# Altium project PCB_Project.PrjPCB
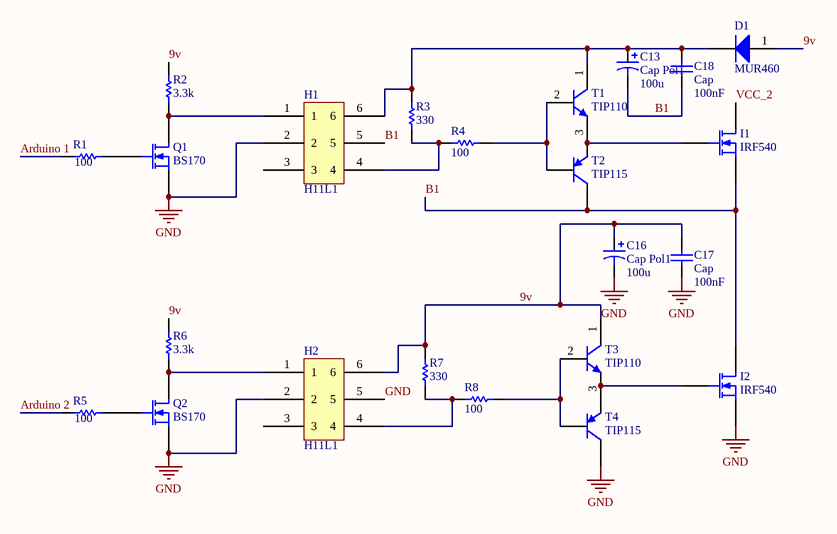
[diagram p0: puente H rama 1.SchDoc]
4 sheets, 82 parts. Net scope: global (net labels, ports and power ports of the same name join across sheets).
Board file: PCB1.PcbDoc
Sheets:
  puente H rama 1.SchDoc
  puente H rama 2.SchDoc
  alimentacion.SchDoc
  micro.SchDoc

## Sheet puente H rama 1.SchDoc
size A4

### Parts
C13  Cap Pol1  value 100u  [A]
C16  Cap Pol1  value 100u  [A]
C17  Cap  value 100nF  [C1206]
C18  Cap  value 100nF  [C1206]
D1  MUR460  [DO-201AD]
H1  H11L1  [DIP-6]
H2  H11L1  [DIP-6]
I1  IRF540  [TO-220AB]
I2  IRF540  [TO-220-AB]
Q1  BS170  [E3]
Q2  BS170  [E3]
R1  value 100  [3216[1206]]  (hidden comment: Res1)
R2  value 3.3k  [3216[1206]]  (hidden comment: Res1)
R3  value 330  [3216[1206]]  (hidden comment: Res1)
R4  value 100  [3216[1206]]  (hidden comment: Res1)
R5  value 100  [3216[1206]]  (hidden comment: Res1)
R6  value 3.3k  [3216[1206]]  (hidden comment: Res1)
R7  value 330  [3216[1206]]  (hidden comment: Res1)
R8  value 100  [3216[1206]]  (hidden comment: Res1)
T1  TIP110  [TO-220-AB]
T2  TIP115  [TO-220-AB]
T3  TIP110  [TO-220-AB]
T4  TIP115  [TO-220-AB]

### Nets
GND: C16.2 C17.1 H1.2 H2.2 H2.5 I2.3(S) Q1.3(S) Q2.3(S) T4.1(C)
9v: C16.1 C17.2 D1.1(A) H2.6 R2.2 R6.2 R7.2 T3.1(C)
Arduino 1: R1.1
Arduino 2: R5.1
B1: C13.2 C18.1 H1.5 I1.3(S) I2.1(D) T2.1(C)
VCC_2: I1.1(D)
NetC13_1: C13.1 C18.2 D1.2(K) H1.6 R3.2 T1.1(C)
NetH1_1: H1.1 Q1.1(D) R2.1
NetH1_4: H1.4 R3.1 R4.2
NetH2_1: H2.1 Q2.1(D) R6.1
NetH2_4: H2.4 R7.1 R8.2
NetI1_2: I1.2(G) T1.3(E) T2.3(E)
NetI2_2: I2.2(G) T3.3(E) T4.3(E)
NetQ1_2: Q1.2(G) R1.2
NetQ2_2: Q2.2(G) R5.2
NetR4_1: R4.1 T1.2(B) T2.2(B)
NetR8_1: R8.1 T3.2(B) T4.2(B)

Not connected (* = marked no-connect by the designer): H1 3; H2 3

### Library data of the parts
C13 C16 = Cap Pol1: Polarized Capacitor (Radial); Published: 8-Jun-2000; LatestRevisionDate: 17-Jul-2002; LatestRevisionNote: Re-released for DXP Platform.; PackageReference: RB7.6-15; Publisher: Altium Limited
C17 C18 = Cap: Capacitor; Published: 8-Jun-2000; LatestRevisionDate: 17-Jul-2002; LatestRevisionNote: Re-released for DXP Platform.; PackageReference: RAD-0.3; Publisher: Altium Limited
D1 = Diode: Default Diode; Published: 8-Jun-2000; LatestRevisionDate: 17-Jul-2002; LatestRevisionNote: Re-released for DXP Platform.; PackageDocument: Sep-1996; PackageReference: SMC; Publisher: Altium Limited; Code_JEDEC: DO-214-AB
I1 I2 = MOSFET-N: N-Channel MOSFET; pin to pad: 1>2 2>1; PackageDocument: 1995/1996; Published: 8-Jun-2000; LatestRevisionDate: 17-Jul-2002; LatestRevisionNote: Re-released for DXP Platform.; PackageReference: E3; Publisher: Altium Limited
Q1 Q2 = MOSFET-N: N-Channel MOSFET; PackageDocument: 1995/1996; Published: 8-Jun-2000; LatestRevisionDate: 17-Jul-2002; LatestRevisionNote: Re-released for DXP Platform.; PackageReference: E3; Publisher: Altium Limited
R1-R8 = Res1: Resistor; Published: 8-Jun-2000; LatestRevisionDate: 17-Jul-2002; LatestRevisionNote: Re-released for DXP Platform.; PackageReference: AXIAL-0.3; Publisher: Altium Limited
T1 T3 = NPN: NPN Bipolar Transistor; pin to pad: 1>2 2>1; Published: 8-Jun-2000; LatestRevisionDate: 17-Jul-2002; LatestRevisionNote: Re-released for DXP Platform.; PackageReference: TO-226; Publisher: Altium Limited; Code_JEDEC: TO-226-AA
T2 T4 = PNP: PNP Bipolar Transistor; pin to pad: 1>2 2>1; Published: 8-Jun-2000; LatestRevisionDate: 17-Jul-2002; LatestRevisionNote: Re-released for DXP Platform.; PackageReference: SOT-23B; Publisher: Altium Limited; Code_JEDEC: SOT-23

## Sheet puente H rama 2.SchDoc
size A4
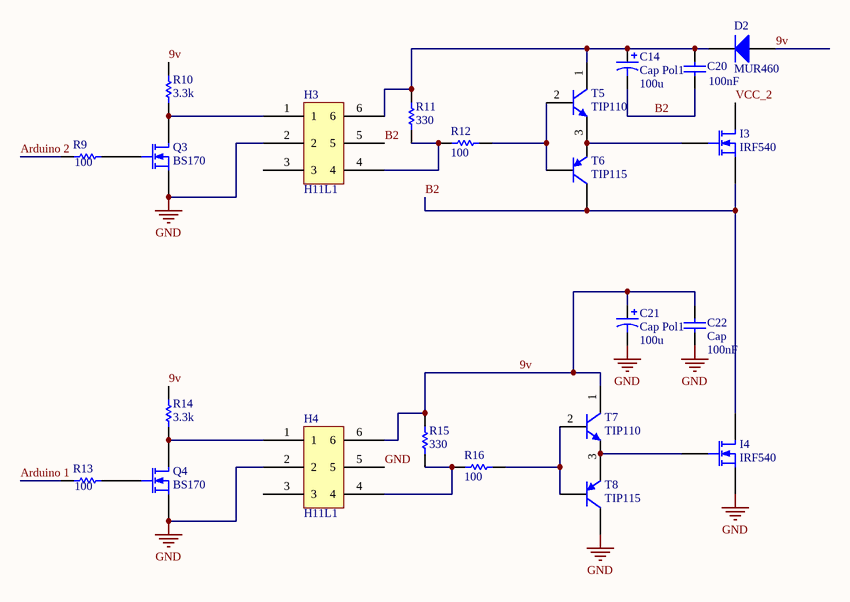
[diagram p1: puente H rama 2.SchDoc]

### Parts
C14  Cap Pol1  value 100u  [A]
C20  value 100nF  [C1206]  (hidden comment: Cap)
C21  Cap Pol1  value 100u  [A]
C22  Cap  value 100nF  [C1206]
D2  MUR460  [DO-201AD]
H3  H11L1  [DIP-6]
H4  H11L1  [DIP-6]
I3  IRF540  [TO-220AB]
I4  IRF540  [TO-220-AB]
Q3  BS170  [E3]
Q4  BS170  [E3]
R9  value 100  [3216[1206]]  (hidden comment: Res1)
R10  value 3.3k  [3216[1206]]  (hidden comment: Res1)
R11  value 330  [3216[1206]]  (hidden comment: Res1)
R12  value 100  [3216[1206]]  (hidden comment: Res1)
R13  value 100  [3216[1206]]  (hidden comment: Res1)
R14  value 3.3k  [3216[1206]]  (hidden comment: Res1)
R15  value 330  [3216[1206]]  (hidden comment: Res1)
R16  value 100  [3216[1206]]  (hidden comment: Res1)
T5  TIP110  [TO-220-AB]
T6  TIP115  [TO-220-AB]
T7  TIP110  [TO-220-AB]
T8  TIP115  [TO-220-AB]

### Nets
GND: C21.2 C22.1 H3.2 H4.2 H4.5 I4.3(S) Q3.3(S) Q4.3(S) T8.1(C)
9v: C21.1 C22.2 D2.1(A) H4.6 R10.2 R14.2 R15.2 T7.1(C)
Arduino 1: R13.1
Arduino 2: R9.1
B2: C14.2 C20.1 H3.5 I3.3(S) I4.1(D) T6.1(C)
VCC_2: I3.1(D)
NetC14_1: C14.1 C20.2 D2.2(K) H3.6 R11.2 T5.1(C)
NetH3_1: H3.1 Q3.1(D) R10.1
NetH3_4: H3.4 R11.1 R12.2
NetH4_1: H4.1 Q4.1(D) R14.1
NetH4_4: H4.4 R15.1 R16.2
NetI3_2: I3.2(G) T5.3(E) T6.3(E)
NetI4_2: I4.2(G) T7.3(E) T8.3(E)
NetQ3_2: Q3.2(G) R9.2
NetQ4_2: Q4.2(G) R13.2
NetR12_1: R12.1 T5.2(B) T6.2(B)
NetR16_1: R16.1 T7.2(B) T8.2(B)

Not connected (* = marked no-connect by the designer): H3 3; H4 3

### Library data of the parts
C14 C21 = Cap Pol1: Polarized Capacitor (Radial); Published: 8-Jun-2000; LatestRevisionDate: 17-Jul-2002; LatestRevisionNote: Re-released for DXP Platform.; PackageReference: RB7.6-15; Publisher: Altium Limited
C20 C22 = Cap: Capacitor; Published: 8-Jun-2000; LatestRevisionDate: 17-Jul-2002; LatestRevisionNote: Re-released for DXP Platform.; PackageReference: RAD-0.3; Publisher: Altium Limited
D2 = Diode: Default Diode; Published: 8-Jun-2000; LatestRevisionDate: 17-Jul-2002; LatestRevisionNote: Re-released for DXP Platform.; PackageDocument: Sep-1996; PackageReference: SMC; Publisher: Altium Limited; Code_JEDEC: DO-214-AB
I3 I4 = MOSFET-N: N-Channel MOSFET; pin to pad: 1>2 2>1; PackageDocument: 1995/1996; Published: 8-Jun-2000; LatestRevisionDate: 17-Jul-2002; LatestRevisionNote: Re-released for DXP Platform.; PackageReference: E3; Publisher: Altium Limited
Q3 Q4 = MOSFET-N: as Q1 on sheet puente H rama 1; Published: 8-Jun-2000; LatestRevisionDate: 17-Jul-2002; LatestRevisionNote: Re-released for DXP Platform.; PackageReference: E3; Publisher: Altium Limited
R9-R16 = Res1: Resistor; Published: 8-Jun-2000; LatestRevisionDate: 17-Jul-2002; LatestRevisionNote: Re-released for DXP Platform.; PackageReference: AXIAL-0.3; Publisher: Altium Limited
T5 T7 = NPN: NPN Bipolar Transistor; pin to pad: 1>2 2>1; Published: 8-Jun-2000; LatestRevisionDate: 17-Jul-2002; LatestRevisionNote: Re-released for DXP Platform.; PackageReference: TO-226; Publisher: Altium Limited; Code_JEDEC: TO-226-AA
T6 T8 = PNP: PNP Bipolar Transistor; pin to pad: 1>2 2>1; Published: 8-Jun-2000; LatestRevisionDate: 17-Jul-2002; LatestRevisionNote: Re-released for DXP Platform.; PackageReference: SOT-23B; Publisher: Altium Limited; Code_JEDEC: SOT-23

## Sheet alimentacion.SchDoc
size A4
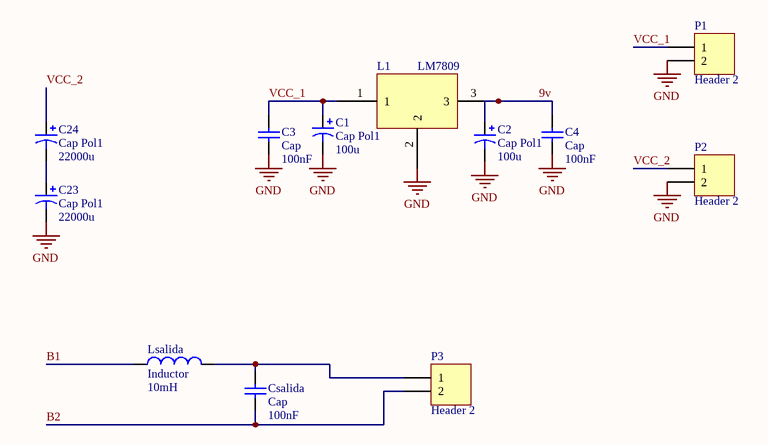
[diagram p2: alimentacion.SchDoc]

### Parts
C1  Cap Pol1  value 100u  [A]
C2  Cap Pol1  value 100u  [A]
C3  Cap  value 100nF  [C1206]
C4  Cap  value 100nF  [C1206]
C23  Cap Pol1  value 22000u  [Capacitor gigante]
C24  Cap Pol1  value 22000u  [Capacitor gigante]
Csalida  Cap  value 100nF  [A]
L1  LM7809  [TO-220AB]
Lsalida  Inductor  value 10mH  [A]
P1  Header 2  [HDR1X2]
P2  Header 2  [HDR1X2]
P3  Header 2  [HDR1X2]

### Nets
GND: C1.2 C2.2 C3.1 C4.1 C23.2 L1.2 P1.2 P2.2
9v: C2.1 C4.2 L1.3
B1: Lsalida.1
B2: Csalida.1 P3.2
VCC_1: C1.1 C3.2 L1.1 P1.1
VCC_2: C24.1 P2.1
NetC23_1: C23.1 C24.2
NetCsalida_2: Csalida.2 Lsalida.2 P3.1

### Library data of the parts
C1 C2 C23 C24 = Cap Pol1: Polarized Capacitor (Radial); Published: 8-Jun-2000; LatestRevisionDate: 17-Jul-2002; LatestRevisionNote: Re-released for DXP Platform.; PackageReference: RB7.6-15; Publisher: Altium Limited
C3 C4 Csalida = Cap: Capacitor; Published: 8-Jun-2000; LatestRevisionDate: 17-Jul-2002; LatestRevisionNote: Re-released for DXP Platform.; PackageReference: RAD-0.3; Publisher: Altium Limited
Lsalida = Inductor: Code_IEC: 1005; Published: 8-Jun-2000; LatestRevisionDate: 17-Jul-2002; LatestRevisionNote: Re-released for DXP Platform.; PackageReference: 0402-A; Publisher: Altium Limited; Code_JEITA: 0402
P1-P3 = Header 2: Header, 2-Pin; LatestRevisionDate: 17-Jul-2002; LatestRevisionNote: Re-released for DXP Platform.; Publisher: Altium Limited

## Sheet micro.SchDoc
size A4
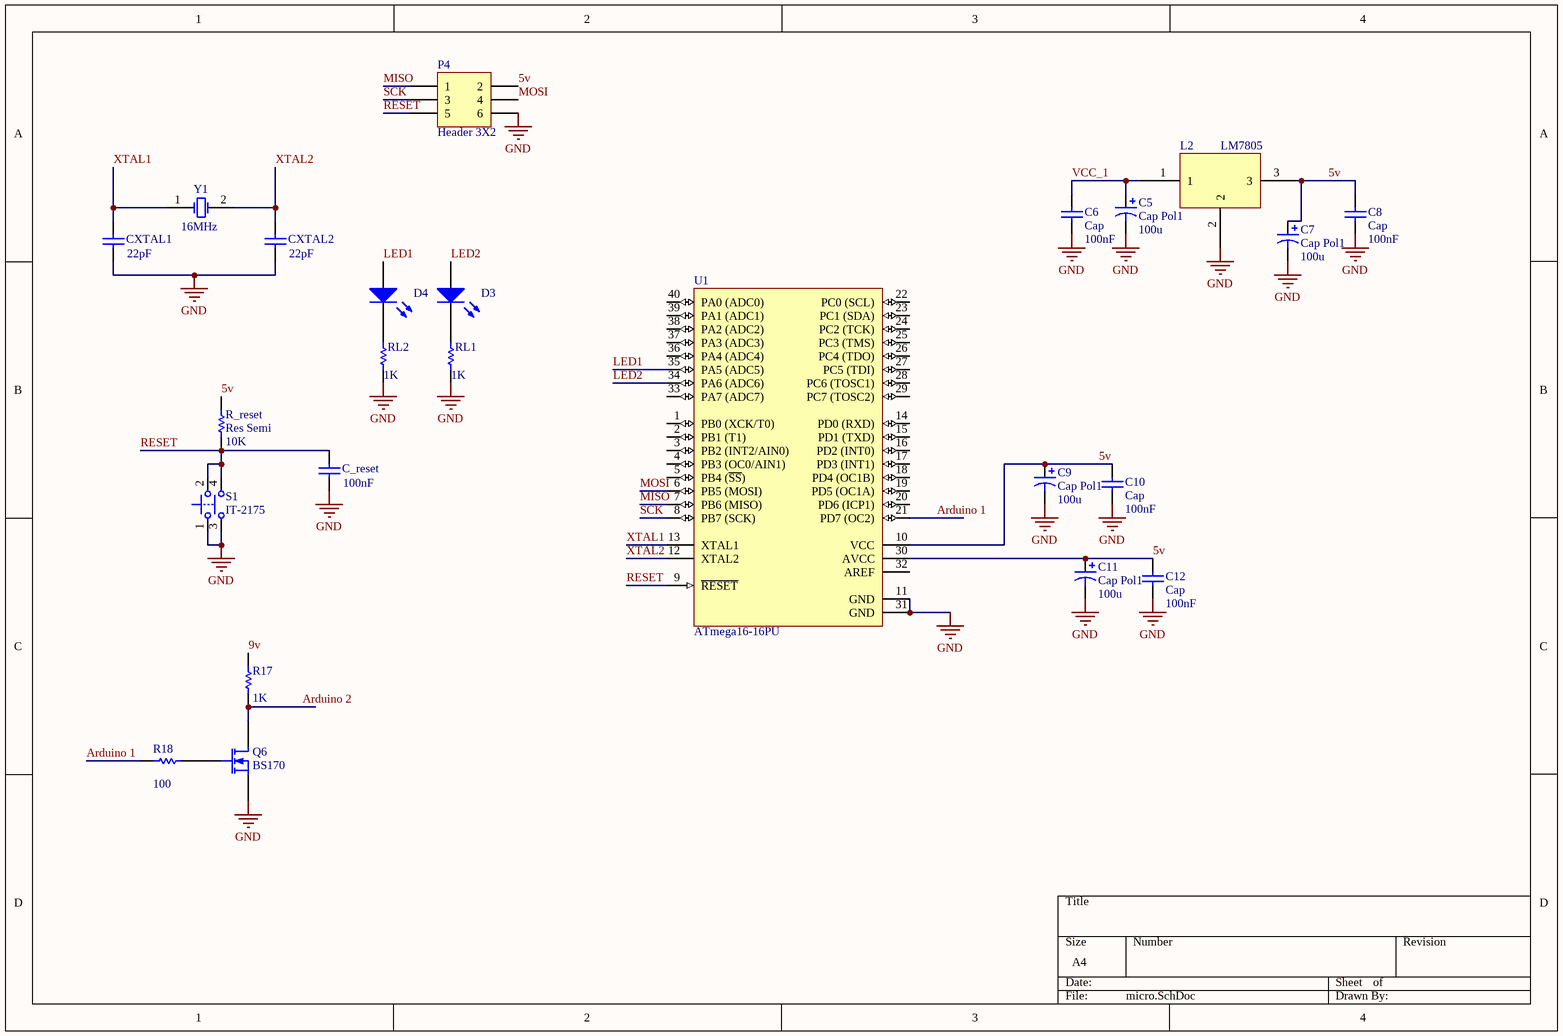
[diagram p3: micro.SchDoc]

### Parts
C5  Cap Pol1  value 100u  [A]
C6  Cap  value 100nF  [C1206]
C7  Cap Pol1  value 100u  [A]
C8  Cap  value 100nF  [C1206]
C9  Cap Pol1  value 100u  [A]
C10  Cap  value 100nF  [C1206]
C11  Cap Pol1  value 100u  [A]
C12  Cap  value 100nF  [C1206]
C_reset  value 100nF  [C1206]  (hidden comment: Ci)
CXTAL1  value 22pF  [C1206]  (hidden comment: Ci)
CXTAL2  value 22pF  [C1206]  (hidden comment: Ci)
D3  LED3  [LED Blue 3mm TH V]  (value not drawn)
D4  LED3  [LED Blue 3mm TH V]  (value not drawn)
L2  LM7805  [TO-220AB]
P4  Header 3X2  [HDR2X3]
Q6  BS170  [E3]
R17  value 1K  [3216[1206]]  (hidden comment: Res Semi)
R18  value 100  [3216[1206]]  (hidden comment: Res Semi)
R_reset  Res Semi  value 10K  [3216[1206]]
RL1  value 1K  [3216[1206]]  (hidden comment: Res Semi)
RL2  value 1K  [3216[1206]]  (hidden comment: Res Semi)
S1  IT-2175  [IT-2175]
U1  ATmega16-16PU  [40P6]
Y1  16MHz  [R38]

### Nets
GND: C5.2 C6.1 C7.2 C8.1 C9.2 C10.1 C11.2 C12.1 C_reset.1 CXTAL1.1 CXTAL2.1 L2.2 P4.6 Q6.3(S) RL1.1 RL2.1 S1.1 S1.3 U1.11(GND) U1.31(GND)
5v: C7.1 C8.2 C9.1 C10.2 C11.1 C12.2 L2.3 P4.2 R_reset.2 U1.10(VCC) U1.30(AVCC)
9v: R17.2
Arduino 1: R18.2 U1.21(PD7_(OC2))
Arduino 2: Q6.1(D) R17.1
LED1: D4.1(A) U1.35(PA5_(ADC5))
LED2: D3.1(A) U1.34(PA6_(ADC6))
MISO: P4.1 U1.7(PB6_(MISO))
MOSI: P4.4 U1.6(PB5_(MOSI))
RESET: C_reset.2 P4.5 R_reset.1 S1.2 S1.4 U1.9(~{RESET})
SCK: P4.3 U1.8(PB7_(SCK))
VCC_1: C5.1 C6.2 L2.1
XTAL1: CXTAL1.2 U1.13(XTAL1) Y1.1(OSC1)
XTAL2: CXTAL2.2 U1.12(XTAL2) Y1.2(OSC2)
NetD3_2: D3.2(K) RL1.2
NetD4_2: D4.2(K) RL2.2
NetQ6_2: Q6.2(G) R18.1

Not connected (* = marked no-connect by the designer): U1 1(PB0_(XCK/T0)) 2(PB1_(T1)) 3(PB2_(INT2/AIN0)) 4(PB3_(OC0/AIN1)) 5(PB4_(~{SS})) 14(PD0_(RXD)) 15(PD1_(TXD)) 16(PD2_(INT0)) 17(PD3_(INT1)) 18(PD4_(OC1B)) 19(PD5_(OC1A)) 20(PD6_(ICP1)) 22(PC0_(SCL)) 23(PC1_(SDA)) 24(PC2_(TCK)) 25(PC3_(TMS)) 26(PC4_(TDO)) 27(PC5_(TDI)) 28(PC6_(TOSC1)) 29(PC7_(TOSC2)) 32(AREF) 33(PA7_(ADC7)) 36(PA4_(ADC4)) 37(PA3_(ADC3)) 38(PA2_(ADC2)) 39(PA1_(ADC1)) 40(PA0_(ADC0))

### Library data of the parts
C5 C7 C9 C11 = Cap Pol1: Polarized Capacitor (Radial); Published: 8-Jun-2000; LatestRevisionDate: 17-Jul-2002; LatestRevisionNote: Re-released for DXP Platform.; PackageReference: RB7.6-15; Publisher: Altium Limited
C6 C8 C10 C12 = Cap: Capacitor; Published: 8-Jun-2000; LatestRevisionDate: 17-Jul-2002; LatestRevisionNote: Re-released for DXP Platform.; PackageReference: RAD-0.3; Publisher: Altium Limited
C_reset CXTAL1 CXTAL2 = Cap Semi: Capacitor (Semiconductor SIM Model); Published: 8-Jun-2000; LatestRevisionDate: 17-Jul-2002; LatestRevisionNote: Re-released for DXP Platform.; PackageReference: C1206; Publisher: Altium Limited
D3 D4 = LED3: Typical BLUE SiC LED; Published: 8-Jun-2000; LatestRevisionDate: 17-Dec-2003; LatestRevisionNote: PCB Footprint replaced.; DatasheetDocument: 16-Apr-2002; PackageDocument: 16-Apr-2002; PackageReference: 3.5X2.8X1.9; Publisher: Altium Limited
L2 = LM7809
P4 = Header 3X2: Header, 3-Pin, Dual row; LatestRevisionDate: 17-Jul-2002; LatestRevisionNote: Re-released for DXP Platform.; Publisher: Altium Limited
Q6 = MOSFET-N: as Q1 on sheet puente H rama 1; Published: 8-Jun-2000; LatestRevisionDate: 17-Jul-2002; LatestRevisionNote: Re-released for DXP Platform.; PackageReference: E3; Publisher: Altium Limited
R17 R18 R_reset RL1 RL2 = Res Semi: Semiconductor Resistor; Published: 8-Jun-2000; LatestRevisionDate: 17-Jul-2002; LatestRevisionNote: Re-released for DXP Platform.; PackageReference: AXIAL-0.5; Publisher: Altium Limited
S1 = IT-2175: Tactile Switch, DPST; Thru-Hole; Vertical; Rating DC 12V, 50mA (max); PackageDocument: Rev.0; Published: 6-Jun-2005; DatasheetDocument: Rev.0; PackageReference: IT-2175; Publisher: Altium Limited; ComponentLink1Description: Manufacturer Link; ComponentLink1URL: http://www.ilswitch.com/; ComponentLink2Description: Device Overview; ComponentLink2URL: http://www.ilswitch.com/list.php?ac_id=010112&ai_id=91
U1 = ATmega16-16PU: 8-bit AVR Microcontroller, 4.5-5.5V, 16KB Flash, 512 Bytes EEPROM, 1KB SRAM, 40-pin PDIP, Industrial Grade (-40°C to 85°C), Pb-Free; DatasheetVersion: revS, May-2009; PackageVersion: revB, Sep-2001; PackageReference: 40P6; PackageDescription: 40-lead (0.600"/15.24mm Wide) Plastic Dual Inline Package (PDIP); Code_JEDEC: MS-011-AC; ComponentLink1Description: Manufacturer URL; ComponentLink1URL: http://www.atmel.com/; ComponentLink2Description: ATmega16(L)  Datasheet; ComponentLink2URL: http://www.atmel.com/dyn/resources/prod_documents/doc2466.pdf; ComponentLink3Description: ATmega16(L) Summary; ComponentLink3URL: http://www.atmel.com/dyn/resources/prod_documents/2466S.pdf
Y1 = XTAL: Crystal Oscillator; Published: 8-Jun-2000; LatestRevisionDate: 17-Jul-2002; LatestRevisionNote: Re-released for DXP Platform.; PackageReference: R38; Publisher: Altium Limited

## Nets that join several sheets
GND: puente H rama 1 (9 pins), puente H rama 2 (9 pins), alimentacion (8 pins), micro (20 pins)
9v: puente H rama 1 (8 pins), puente H rama 2 (8 pins), alimentacion (C2.1 C4.2 L1.3), micro (R17.2)
Arduino 1: puente H rama 1 (R1.1), puente H rama 2 (R13.1), micro (R18.2 U1.21)
Arduino 2: puente H rama 1 (R5.1), puente H rama 2 (R9.1), micro (Q6.1 R17.1)
B1: puente H rama 1 (6 pins), alimentacion (Lsalida.1)
B2: puente H rama 2 (6 pins), alimentacion (Csalida.1 P3.2)
VCC_1: alimentacion (C1.1 C3.2 L1.1 P1.1), micro (C5.1 C6.2 L2.1)
VCC_2: puente H rama 1 (I1.1), puente H rama 2 (I3.1), alimentacion (C24.1 P2.1)